# Altium schematic sheet Power Conversion.SchDoc
size A4
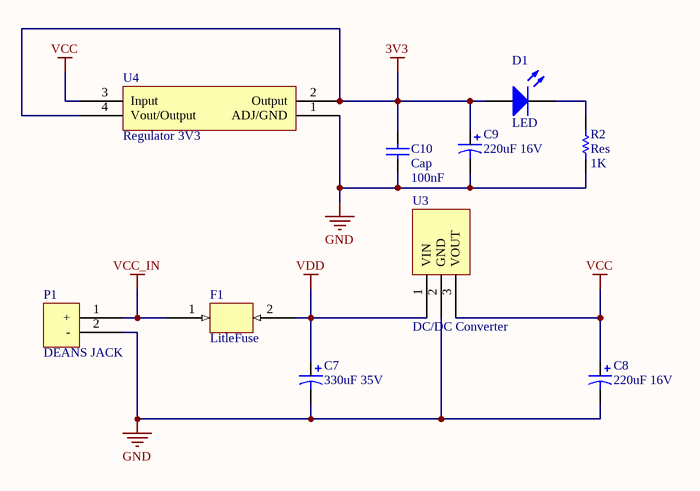
[diagram p0: Power Conversion.SchDoc]

## Parts
C7  330uF 35V  [CAP 330uF 35V SMD]
C8  220uF 16V  [CAP 220uF 16V]
C9  220uF 16V  [CAP 220uF 16V]
C10  Cap  value 100nF  [0603-CAP]
D1  LED  [CHIPLED_0603]
F1  LitleFuse  [LitleFuse]
P1  DEANS JACK  [Deans Jack]
R2  Res  value 1K  [0603-RES]
U3  DC/DC Converter  [DC/DC Converter]
U4  Regulator 3V3  [Regulator 3V3 SOT230]

## Nets
3V3: C9.1 C10.1 D1.1(A) U4.2(Output) U4.4(Vout/Output)
GND: C7.2 C8.2 C9.2 C10.2 P1.2(-) R2.1 U3.2(GND) U4.1(ADJ/GND)
VCC: C8.1 U3.3(VOUT) U4.3(Input)
VCC_IN: F1.1 P1.1(+)
VDD: C7.1 F1.2 U3.1(VIN)
NetD1_2: D1.2(K) R2.2

## Library data of the parts
C10 = Cap: Capacitor; Published: 8-Jun-2000; LatestRevisionDate: 17-Jul-2002; LatestRevisionNote: Re-released for DXP Platform.; PackageReference: RAD-0.3; Publisher: Altium Limited; PackageDescription: Radial Cap, Thru-Hole; 2 Leads; 0.3 in Pin Spacing
D1 = LED: Typical INFRARED GaAs LED; Published: 8-Jun-2000; LatestRevisionDate: 08-Jul-2005; LatestRevisionNote: Mech Layer 1 removed.; PackageReference: LED-0; Publisher: Altium Limited; PackageDescription: LED; 2 Leads
R2 = Res: Resistor; Published: 8-Jun-2000; LatestRevisionDate: 17-Jul-2002; LatestRevisionNote: Re-released for DXP Platform.; PackageReference: AXIAL-0.3; Publisher: Altium Limited; PackageDescription: Axial Device, Thru-Hole; 2 Leads; 0.3 in Pin Spacing